# Altium schematic sheet st-link_v2_hall_crossboard_1_1.SchDoc
size A4
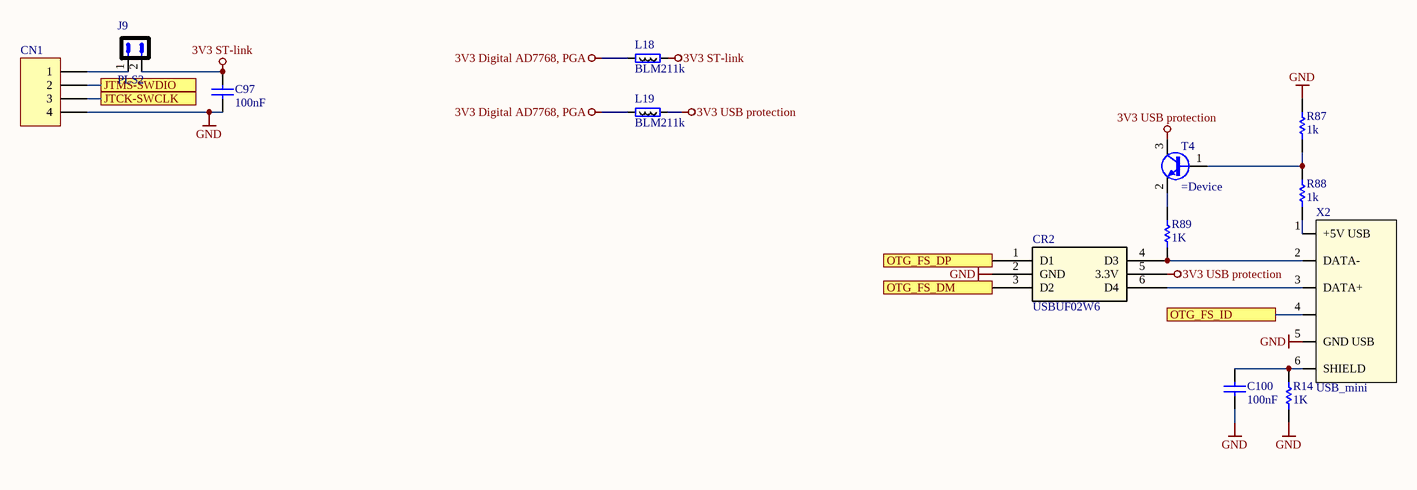
[diagram p0: st-link_v2_hall_crossboard_1_1.SchDoc]

## Parts
C97  100nF  [0603C]
C100  100nF  [0603C]
CN1  Header 4  [HDR_1x4_2R54_V_M]  (value not drawn)
CR2  USBUF02W6  [SOTT323-6L_STM-M]
J9  PLS2  [SAMTEC_TSW-102-23-L-S]
L18  BLM211k  [RESC2012X50N]
L19  BLM211k  [RESC2012X50N]
R14  1K  [0603R]
R87  1k  [0603R]
R88  1k  [0603R]
R89  1K  [0603R]
T4  (no value)  [SOT-23]
X2  USB_mini  [TYCO_1734035-1]

## Ports
JTCK-SWCLK, JTMS-SWDIO, OTG_FS_DM, OTG_FS_DP, OTG_FS_ID

## Nets
3V3 Digital AD7768, PGA: L18.2 L19.2
3V3 ST-link: C97.2 J9.2 L18.1
3V3 USB protection: CR2.5(3.3V) L19.1 T4.3(C)
GND: C97.1 C100.1 CN1.4 CR2.2(GND) R14.1 R87.2 X2.5(GND_USB)
JTCK-SWCLK: CN1.3 ; port JTCK-SWCLK
JTMS-SWDIO: CN1.2 ; port JTMS-SWDIO
OTG_FS_DM: CR2.3(D2) ; port OTG_FS_DM
OTG_FS_DP: CR2.1(D1) ; port OTG_FS_DP
OTG_FS_ID: X2.4 ; port OTG_FS_ID
NetC100_2: C100.2 R14.2 X2.6(SHIELD)
NetCN1_1: CN1.1 J9.1
NetCR2_4: CR2.4(D3) R89.1 X2.2(DATA-)
NetCR2_6: CR2.6(D4) X2.3(DATA+)
NetR87_1: R87.1 R88.2 T4.1(B)
NetR88_1: R88.1 X2.1(+5V_USB)
NetR89_2: R89.2 T4.2(E)

## Library data of the parts
C97 C100 = Capacitor_ST: Capacitor 0402 / 0603 / 0805; Revision: July-2002: Re-released for DXP Platform.; Value: 100nF
CN1 = Header 4: Header, 4-Pin, Single row; Revision: 17-Jul-2002: Re-released for DXP Platform.; Publisher: Altium Limited
CR2 = USBUF02W6: USB protection; Mfr_Name: STMicroelectronics; RefDes: RefDes; Type: Type
J9 = PLS2: Vendor: Confly; SMD Solders: 0; Solder Option: RM; THD Solders: 2; Price: 1; Device: PLS2
L18 L19 = BLM21: SMD Ferrite bead 0805; Vendor: Vishay; Value: 1k; Pkg: SMD0805; SMD Solders: 2; Solder Option: RM; Device: BLM21; Price: 10
R14 R89 = Resistor_ST: Resistor 0402 / 0603 / 0805; Value: 10K
R87 R88 = Resistor_ST: Resistor 0402 / 0603 / 0805; Value: 1k
T4 = BC846: Bipolar transistor
X2 = USB_mini: Вилка  PLS 6x2.54; Vendor: TE Connectivity; SolderOption: Norm; Price: 50; Value: USB_mini